# Altium schematic sheet [4]-RK3399 EDP_CSI_HDMI.SchDoc: RK3399 SOM Board Design V1.0
size A4; Author: AVIRAL MISHRA; DocumentNumber: 6; SheetNumber: 6; SheetTotal: 21; PROJECT CODE: A_V1.0
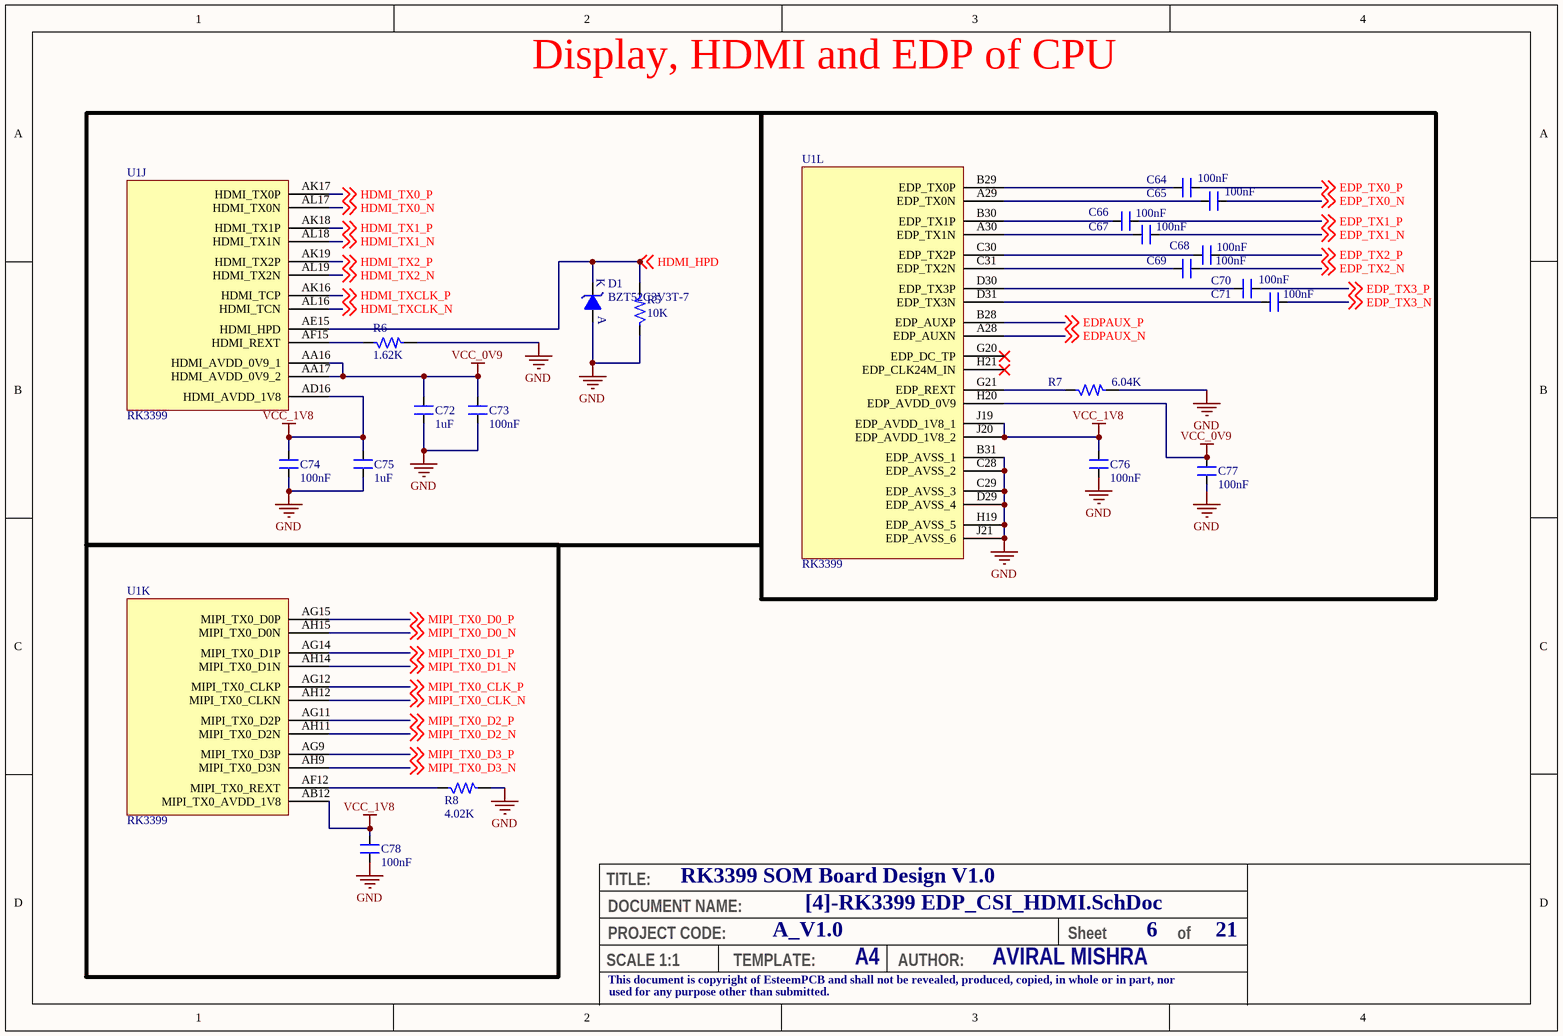
[diagram p0: [4]-RK3399 EDP_CSI_HDMI.SchDoc]

## Parts
C64  100nF  [CAP_0201]
C65  100nF  [CAP_0201]
C66  100nF  [CAP_0201]
C67  100nF  [CAP_0201]
C68  100nF  [CAP_0201]
C69  100nF  [CAP_0201]
C70  100nF  [CAP_0201]
C71  100nF  [CAP_0201]
C72  1uF  [CAP_0201]
C73  100nF  [CAP_0201]
C74  100nF  [CAP_0201]
C75  1uF  [CAP_0201]
C76  100nF  [CAP_0201]
C77  100nF  [CAP_0201]
C78  100nF  [CAP_0201]
D1  BZT52C3V3T-7  [DIO_SOD523]
R5  10K  [RES_0201]
R6  1.62K  [RES_0201]
R7  6.04K  [RES_0201]
R8  4.02K  [RES_0201]
U1  RK3399  [FBGA828_23_826X826]  (parts J,K,L of 24)

## Nets
GND: C72.1 C73.1 C74.1 C75.1 C76.2 C77.1 C78.1 D1.A R5.1 R6.2 R7.2 R8.2 U1.B31(EDP_AVSS_1) U1.C28(EDP_AVSS_2) U1.C29(EDP_AVSS_3) U1.D29(EDP_AVSS_4) U1.H19(EDP_AVSS_5) U1.J21(EDP_AVSS_6)
VCC_0V9: C72.2 C73.2 C77.2 U1.AA16(HDMI_AVDD_0V9_1) U1.AA17(HDMI_AVDD_0V9_2) U1.H20(EDP_AVDD_0V9)
VCC_1V8: C74.2 C75.2 C76.1 C78.2 U1.AB12(MIPI_TX0_AVDD_1V8) U1.AD16(HDMI_AVDD_1V8) U1.J19(EDP_AVDD_1V8_1) U1.J20(EDP_AVDD_1V8_2)
EDP_TX0_N: C65.1 ; off-sheet EDP_TX0_N
EDP_TX0_P: C64.1 ; off-sheet EDP_TX0_P
EDP_TX1_N: C67.1 ; off-sheet EDP_TX1_N
EDP_TX1_P: C66.1 ; off-sheet EDP_TX1_P
EDP_TX2_N: C69.1 ; off-sheet EDP_TX2_N
EDP_TX2_P: C68.1 ; off-sheet EDP_TX2_P
EDP_TX3_N: C71.1 ; off-sheet EDP_TX3_N
EDP_TX3_P: C70.1 ; off-sheet EDP_TX3_P
EDPAUX_N: U1.A28(EDP_AUXN) ; off-sheet EDPAUX_N
EDPAUX_P: U1.B28(EDP_AUXP) ; off-sheet EDPAUX_P
HDMI_HPD: D1.K R5.2 U1.AE15(HDMI_HPD) ; off-sheet HDMI_HPD
HDMI_TX0_N: U1.AL17(HDMI_TX0N) ; off-sheet HDMI_TX0_N
HDMI_TX0_P: U1.AK17(HDMI_TX0P) ; off-sheet HDMI_TX0_P
HDMI_TX1_N: U1.AL18(HDMI_TX1N) ; off-sheet HDMI_TX1_N
HDMI_TX1_P: U1.AK18(HDMI_TX1P) ; off-sheet HDMI_TX1_P
HDMI_TX2_N: U1.AL19(HDMI_TX2N) ; off-sheet HDMI_TX2_N
HDMI_TX2_P: U1.AK19(HDMI_TX2P) ; off-sheet HDMI_TX2_P
HDMI_TXCLK_N: U1.AL16(HDMI_TCN) ; off-sheet HDMI_TXCLK_N
HDMI_TXCLK_P: U1.AK16(HDMI_TCP) ; off-sheet HDMI_TXCLK_P
MIPI_TX0_CLK_N: U1.AH12(MIPI_TX0_CLKN) ; off-sheet MIPI_TX0_CLK_N
MIPI_TX0_CLK_P: U1.AG12(MIPI_TX0_CLKP) ; off-sheet MIPI_TX0_CLK_P
MIPI_TX0_D0_N: U1.AH15(MIPI_TX0_D0N) ; off-sheet MIPI_TX0_D0_N
MIPI_TX0_D0_P: U1.AG15(MIPI_TX0_D0P) ; off-sheet MIPI_TX0_D0_P
MIPI_TX0_D1_N: U1.AH14(MIPI_TX0_D1N) ; off-sheet MIPI_TX0_D1_N
MIPI_TX0_D1_P: U1.AG14(MIPI_TX0_D1P) ; off-sheet MIPI_TX0_D1_P
MIPI_TX0_D2_N: U1.AH11(MIPI_TX0_D2N) ; off-sheet MIPI_TX0_D2_N
MIPI_TX0_D2_P: U1.AG11(MIPI_TX0_D2P) ; off-sheet MIPI_TX0_D2_P
MIPI_TX0_D3_N: U1.AH9(MIPI_TX0_D3N) ; off-sheet MIPI_TX0_D3_N
MIPI_TX0_D3_P: U1.AG9(MIPI_TX0_D3P) ; off-sheet MIPI_TX0_D3_P
NetC64_2: C64.2 U1.B29(EDP_TX0P)
NetC65_2: C65.2 U1.A29(EDP_TX0N)
NetC66_2: C66.2 U1.B30(EDP_TX1P)
NetC67_2: C67.2 U1.A30(EDP_TX1N)
NetC68_2: C68.2 U1.C30(EDP_TX2P)
NetC69_2: C69.2 U1.C31(EDP_TX2N)
NetC70_2: C70.2 U1.D30(EDP_TX3P)
NetC71_2: C71.2 U1.D31(EDP_TX3N)
NetR6_1: R6.1 U1.AF15(HDMI_REXT)
NetR7_1: R7.1 U1.G21(EDP_REXT)
NetR8_1: R8.1 U1.AF12(MIPI_TX0_REXT)

Not connected (* = marked no-connect by the designer): U1 G20(EDP_DC_TP)* H21(EDP_CLK24M_IN)*

## Notes on the sheet
- Display, HDMI and EDP of CPU
- TITLE:
- DOCUMENT NAME:
- SCALE 1:1
- This document is copyright of EsteemPCB and shall not be revealed, produced, copied, in whole or in part, nor
- PROJECT CODE:
- TEMPLATE:
- A4
- AUTHOR:
- Sheet
- of
- used for any purpose other than submitted.

## Library data of the parts
C64-C71 C73 C74 C76-C78 = CAP_100nF-25V-10%-0201: 0.1µF ±10% 25V Ceramic Capacitor X5R 0201 (0603 Metric) /; Manufacturer: TDK Corporation; Manufacturer Part Number: C0603X5R1E104K030BB; Case/Package: 0201; Supplier-1: Digikey
C72 C75 = CAP_1uF-16V-10%-0201: 1µF ±20% 16V Ceramic Capacitor X5R 0201 (0603 Metric) /; Manufacturer: Samsung Electro-Mechanics; Manufacturer Part Number: CL03A105MO3NRNH; Case/Package: 0201; Supplier-1: Digikey
D1 = DIO-Z_3.3V-300mW-SOD-523: Zener Diode 3.3V 300mW ±6% Surface Mount SOD-523 /; Manufacturer: Diodes Incorporated; Manufacturer Part Number: BZT52C3V3T-7; Case/Package: SOD523; Supplier-1: Digikey
R5 = RES_10K-0.05W-1%-0201: 10 kOhms ±1% 0.05W, 1/20W Chip Resistor 0201 (0603 Metric) Thick Film /; Manufacturer: Stackpole Electronics Inc; Manufacturer Part Number: RMCF0201FT10K0; Case/Package: 0201; Supplier-1: Digikey
R6 = RES_1.62K-0.05W-1%-0201: 1.62 kOhms ±1% 0.05W, 1/20W Chip Resistor 0201 (0603 Metric) Automotive AEC-Q200 Thick Film /; Manufacturer: Panasonic Electronic Components; Manufacturer Part Number: ERJ-1GNF1621C; Case/Package: 0201; Supplier-1: Digikey
R7 = RES_6.04K-0.05W-1%-0201: 6.04 kOhms ±1% 0.05W, 1/20W Chip Resistor 0201 (0603 Metric) Thick Film /; Manufacturer: Panasonic Electronic Components; Manufacturer Part Number: ERJ-1GEF6041C; Case/Package: 0201; Supplier-1: Digikey
R8 = RES_4.02K-0.05W-1%-0201: 4.02 kOhms ±1% 0.05W, 1/20W Chip Resistor 0201 (0603 Metric) Thick Film /; Manufacturer: Yageo; Manufacturer Part Number: RC0201FR-074K02L; Case/Package: 0201; Supplier-1: Digikey
U1 = IC_RK3399-FCBGA828: RK3399 is a low power, high performance processor for computing, personal mobile.; Manufacturer: Rockchip; Manufacturer Part Number: RK3399; Case/Package: FCBGA828; Supplier-1: Rockchip